# EAGLE design USBasp (EAGLE 6.3)
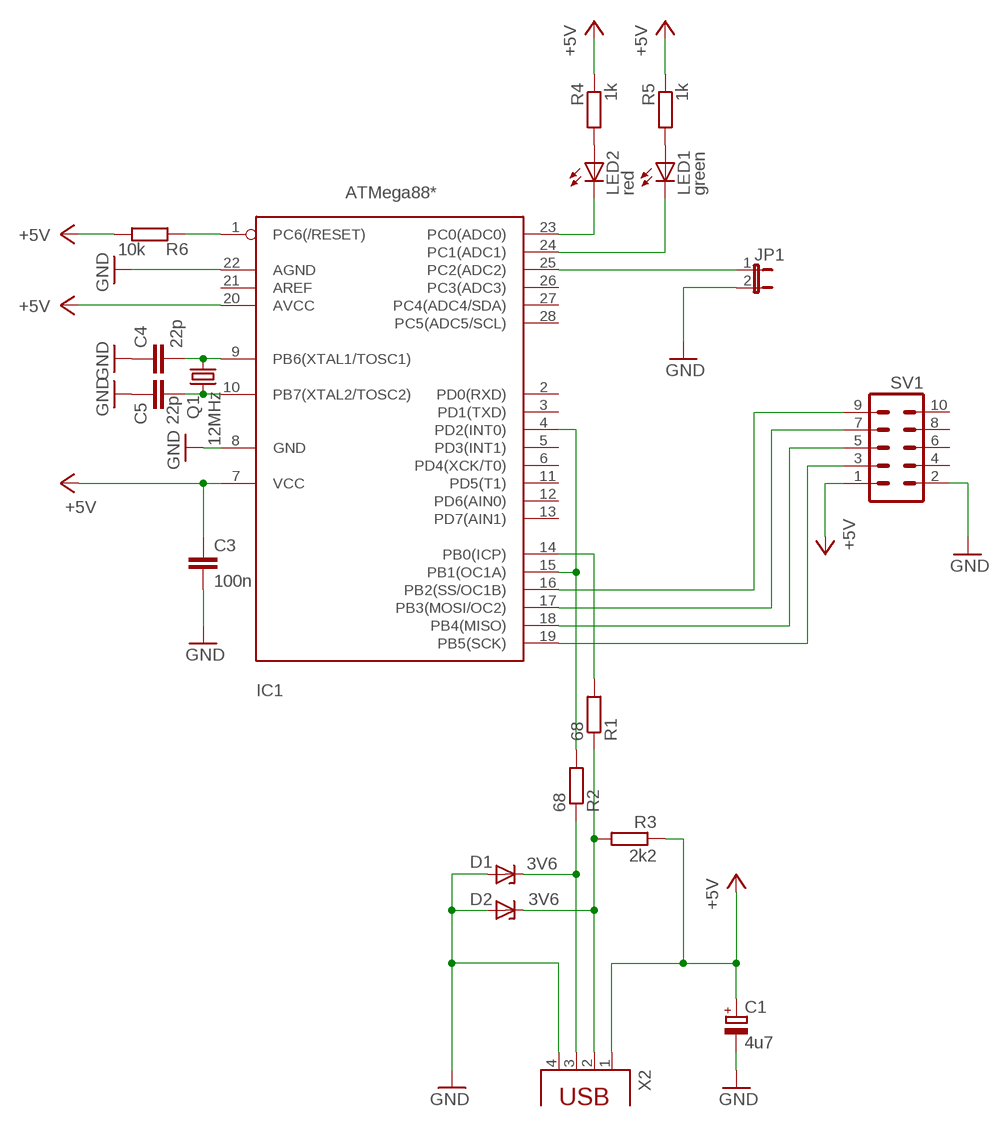
[diagram p0: schematic, sheet 1]

## Parts
C1  4u7  CPOL-EUE2.5-5  [E2,5-5]
C3  100n  C-EU025-024X044  [C025-024X044]
C4  22p  C-EU025-024X044  [C025-024X044]
C5  22p  C-EU025-024X044  [C025-024X044]
D1  3V6  ZENER-DIODEDO34-7  [DO34Z7]
D2  3V6  ZENER-DIODEDO34-7  [DO34Z7]
IC1  ATMega88*  MEGA8-P  [DIL28-3]
JP1  JP1E  [JP1]
LED1  green  LED3MM  [LED3MM]
LED2  red  LED3MM  [LED3MM]
Q1  12MHz  CRYTALHC49S  [HC49/S]
R1  68  R-EU_0207/10  [0207/10]
R2  68  R-EU_0207/10  [0207/10]
R3  2k2  R-EU_0207/10  [0207/10]
R4  1k  R-EU_0207/10  [0207/10]
R5  1k  R-EU_0207/10  [0207/10]
R6  10k  R-EU_0207/10  [0207/10]
SV1  MA05-2  [MA05-2]
X2  PN87520  [PN87520]

## Nets
+5V: C1.+ C3.1 IC1.7(VCC) IC1.20(AVCC) R3.1 R4.1 R5.1 R6.1 SV1.1 X2.1
GND: C1.- C3.2 C4.1 C5.1 D1.A D2.A IC1.8(GND) IC1.22(AGND) JP1.2 SV1.2 X2.4
N$1: IC1.25(PC2(ADC2)) JP1.1
N$2: IC1.19(PB5(SCK)) SV1.3
N$3: IC1.1(PC6(/RESET)) R6.2
N$4: IC1.18(PB4(MISO)) SV1.5
N$5: D2.C R1.1 R3.2 X2.2
N$6: IC1.17(PB3(MOSI/OC2)) SV1.7
N$7: IC1.4(PD2(INT0)) IC1.15(PB1(OC1A)) R2.2
N$8: D1.C R2.1 X2.3
N$9: IC1.16(PB2(SS/OC1B)) SV1.9
N$13: LED2.A R4.2
N$14: IC1.23(PC0(ADC0)) LED2.K(C)
N$15: IC1.24(PC1(ADC1)) LED1.K(C)
N$16: IC1.14(PB0(ICP)) R1.2
N$22: C4.2 IC1.9(PB6(XTAL1/TOSC1)) Q1.2
N$23: C5.2 IC1.10(PB7(XTAL2/TOSC2)) Q1.1
N$25: LED1.A R5.2
Unconnected: IC1.2(PD0(RXD)) IC1.3(PD1(TXD)) IC1.5(PD3(INT1)) IC1.6(PD4(XCK/T0)) IC1.11(PD5(T1)) IC1.12(PD6(AIN0)) IC1.13(PD7(AIN1)) IC1.21(AREF) IC1.26(PC3(ADC3)) IC1.27(PC4(ADC4/SDA)) IC1.28(PC5(ADC5/SCL)) SV1.4 SV1.6 SV1.8 SV1.10

## Library data of the parts
C1 = rcl:CPOL-EU: POLARIZED CAPACITOR, European symbol
C3-C5 = rcl:C-EU: CAPACITOR, European symbol
D1 D2 = diode:ZENER-DIODE: Z-Diode
IC1 = atmel:MEGA8-P: MICROCONTROLLER 8 Kbytes FLASH 1 kbytes SRAM 512 bytes EEPROM USART 4-channel 10 bit ADC 2-channel 8 bit ADC Source: avr.lbr
JP1 = jumper:JP1E: JUMPER
LED1 LED2 = led:LED: LED OSRAM: - CHIPLED LG R971, LG N971, LY N971, LG Q971, LY Q971, LO R971, LY R971 LH N974, LH R974 LS Q976, LO Q976, LY Q976 LO Q996 - Hyper CHIPLED LW Q18S LB Q993, LB Q99A, LB R99A - SideLED LS A670, LO A670, LY A670, LG A670, LP A670 LB A673, LV A673, LT A673, LW A673 LH A674 LY A675 LS A676, LA A676, LO A676, LY A676, LW A676 LS A679, LY A679, LG A679 - Hyper Micro SIDELED® LS Y876, LA Y876, LO Y876, LY Y876 LT Y87S - SmartLED LW L88C, LW L88S LB L89C, LB L89S, LG L890 LS L89K, LO L89K, LY L89K LS L896, LA L896, LO L896, LY L896 - TOPLED LS T670, LO T670, LY T670, LG T670, LP T670 LSG T670, LSP T670, LSY T670, LOP T670, LYG T670 LG T671, LOG T671, LSG T671 LB T673, LV T673, LT T673, LW T673 LH T674 LS T676, LA T676, LO T676, LY T676, LB T676, LH T676, LSB T676, LW T676 LB T67C, LV T67C, LT T67C, LS T67K, LO T67K, LY T67K, LW E67C LS E67B, LA E67B, LO E67B, LY E67B, LB E67C, LV E67C, LT E67C LW T67C LS T679, LY T679, LG T679 LS T770, LO T770, LY T770, LG T770, LP T770 LB T773, LV T773, LT T773, LW T773 LH T774 LS E675, LA E675, LY E675, LS T675 LS T776, LA T776, LO T776, LY T776, LB T776 LHGB T686 LT T68C, LB T68C - Hyper Mini TOPLED® LB M676 - Mini TOPLED Santana® LG M470 LS M47K, LO M47K, LY M47K Source: http://www.osram.convergy.de/
Q1 = crystal:CRYTAL: CRYSTAL
R1-R6 = rcl:R-EU_: RESISTOR, European symbol
SV1 = con-lstb:MA05-2: PIN HEADER; OC_FARNELL: unknown; OC_NEWARK: unknown
X2 = con-berg:PN87520: BERG USB connector; OC_FARNELL: unknown; OC_NEWARK: unknown

## Board
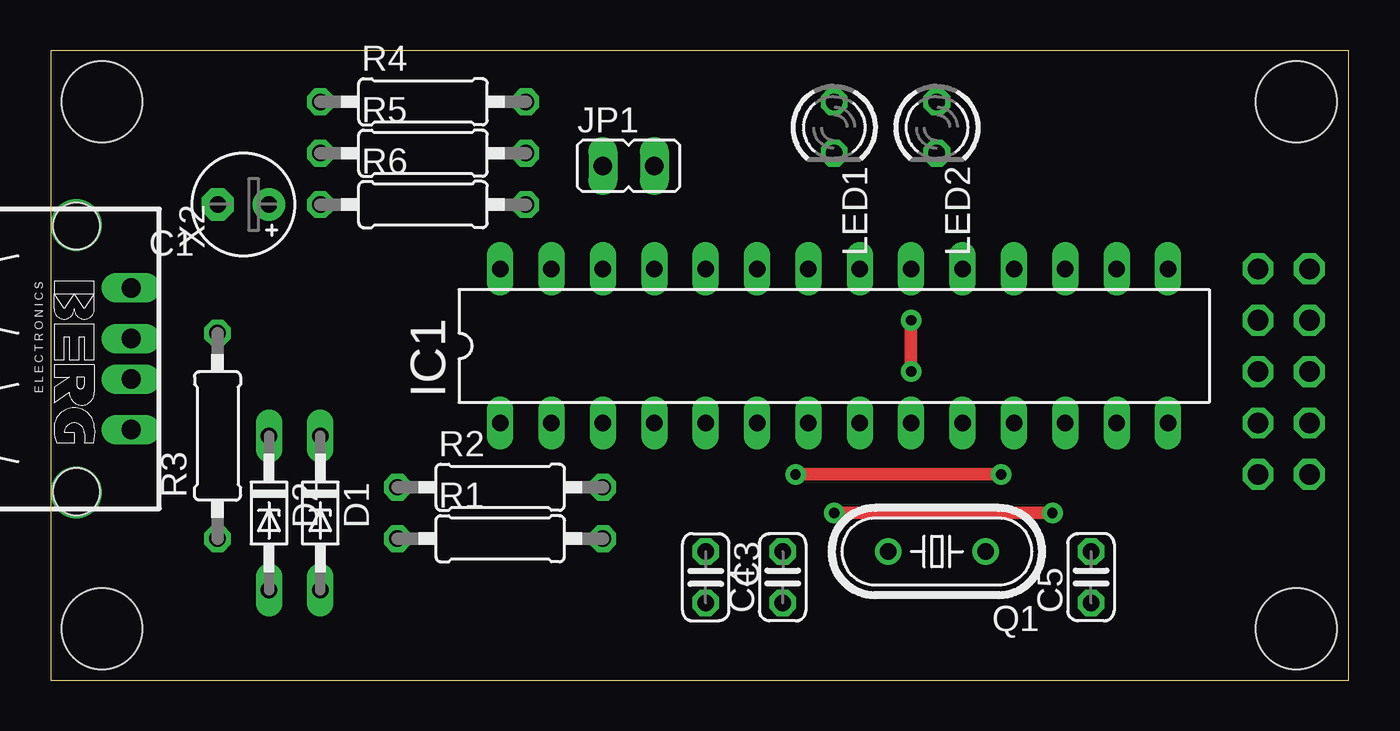
[diagram p1: board, top side]
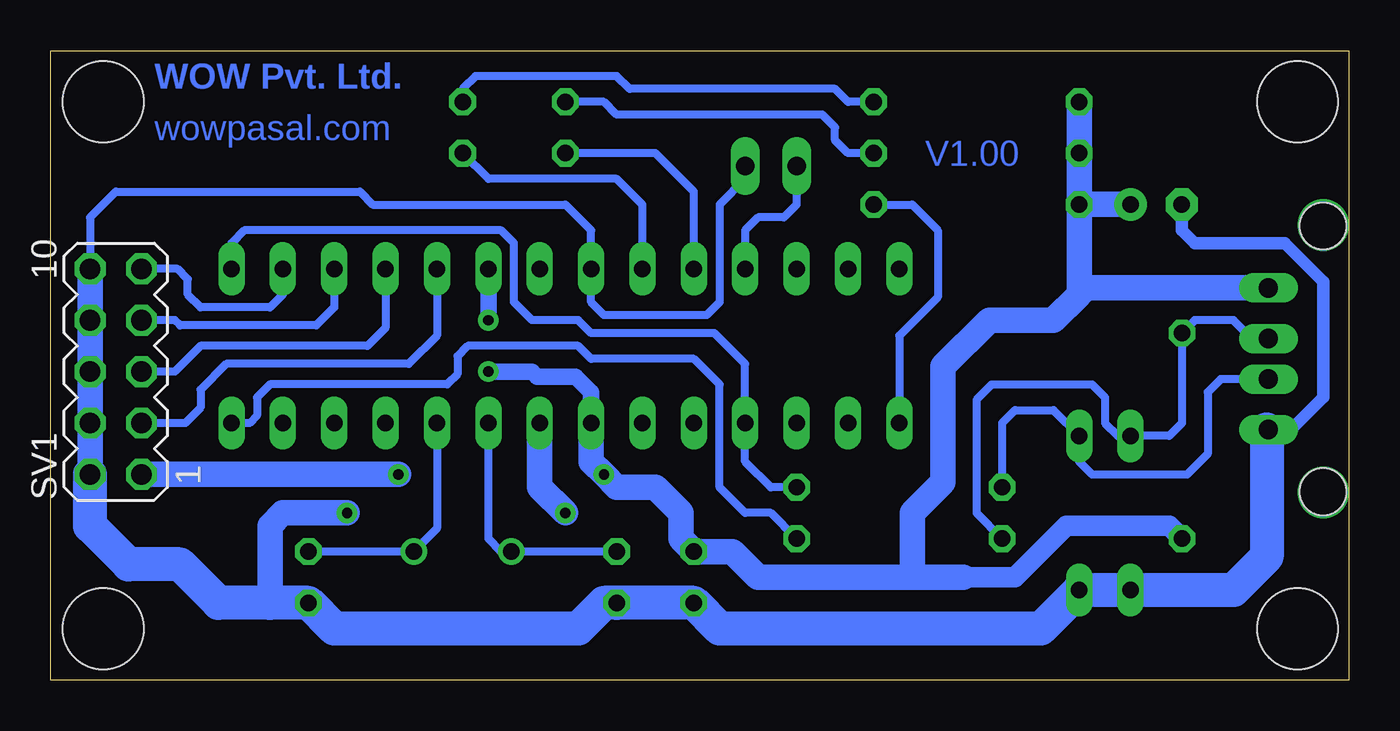
[diagram p2: board, bottom side, seen from below]

Size 64.19 x 31.11 mm. Coordinates in mm from the lower left corner, seen from the top.
Outline: 0,0 64.19,0 64.19,31.11 0,31.11 0,0
Copper layers (1*16): Top 0.035mm / dielectric 1.5mm / Bottom 0.035mm
Design rules "default": minimum track width 10mil, minimum drill 24mil, track to track 8mil, track to pad 8mil, pad to pad 8mil, via to via 8mil, smd to smd 8mil, copper to edge 40mil, drill to drill 8mil, minimum pad ring 10mil, minimum via ring 8mil, stop-mask expansion 4mil, vias tented up to drill 0mil, thermal gap 10mil
Holes 4 mm at 2.54,28.57 61.59,28.57 2.54,2.54 61.59,2.54

### Footprints (pad centres in the part's own frame; a part is rotated, then mirrored left to right if it is on the bottom)
E2,5-5 = drill 0.813 pad 1.6: + -1.27,0 | drill 0.813 pad 1.6 octagon: - 1.27,0
C025-024X044 = drill 0.813 octagon: 1 -1.27,0; 2 1.27,0
DO34Z7 = drill 0.813 long: A 3.81,0; C -3.81,0
DIL28-3 = drill 0.813 long: 1 -16.51,-3.81; 2 -13.97,-3.81; 3 -11.43,-3.81; 4 -8.89,-3.81; 5 -6.35,-3.81; 6 -3.81,-3.81; 7 -1.27,-3.81; 8 1.27,-3.81; 9 3.81,-3.81; 10 6.35,-3.81; 11 8.89,-3.81; 12 11.43,-3.81; 13 13.97,-3.81; 14 16.51,-3.81; 15 16.51,3.81; 16 13.97,3.81; 17 11.43,3.81; 18 8.89,3.81; 19 6.35,3.81; 20 3.81,3.81; 21 1.27,3.81; 22 -1.27,3.81; 23 -3.81,3.81; 24 -6.35,3.81; 25 -8.89,3.81; 26 -11.43,3.81; 27 -13.97,3.81; 28 -16.51,3.81
JP1 = drill 0.914 long: 1 0,-1.27; 2 0,1.27
LED3MM = drill 0.813 octagon: A -1.27,0; K 1.27,0
HC49/S = drill 0.813: 1 -2.413,0; 2 2.413,0
0207/10 = drill 0.813 octagon: 1 -5.08,0; 2 5.08,0
MA05-2 = drill 1.016 octagon: 1 -5.08,-1.27; 2 -5.08,1.27; 3 -2.54,-1.27; 4 -2.54,1.27; 5 0,-1.27; 6 0,1.27; 7 2.54,-1.27; 8 2.54,1.27; 9 5.08,-1.27; 10 5.08,1.27
PN87520 = drill 0.95 long: 1 -3.5,2.71; 2 -1,2.71; 3 1,2.71; 4 3.5,2.71 | hole 2.3: -6.57,0; 6.57,0

### Placement (x,y rotation side)
C1  9.53,23.5 180 top
C3  32.38,5.08 270 top
C4  36.2,5.08 90 top
C5  51.44,5.08 90 top
D1  13.34,8.26 270 top
D2  10.79,8.26 270 top
IC1  38.73,16.51 0 top
JP1  28.57,25.4 270 top
LED1  38.73,27.3 270 top
LED2  43.81,27.3 270 top
Q1  43.81,6.35 180 top
R1  22.23,6.99 0 top
R2  22.23,9.53 0 top
R3  8.26,12.06 90 top
R4  18.41,28.57 0 top
R5  18.41,26.04 0 top
R6  18.41,23.5 0 top
SV1  60.96,15.24 90 bottom
X2  1.27,15.88 270 top

### Tracks (layer width: path | path; a pad name or v marks a point on that pad's centre or on a via)
+5V  (via drill 0.51 pad 1.02)
  Top 0.61: v42.55,17.78 v42.55,15.24 | v36.83,10.16 v46.99,10.16
  Bottom 0.813: IC1.7 37.47,14.22 38.23,14.99 40.13,14.99 40.39,15.24 v42.55,15.24 | v42.55,17.78 IC1.20
  Bottom 1.016: 19.05,5.08 16.51,5.08 13.97,7.62 8.89,7.62 R3.1
  Bottom 1.27: R6.1 R5.1 R4.1 | SV1.1 v46.99,10.16 | 19.05,5.08 21.59,5.08 | 21.59,5.08 29.21,5.08 30.48,6.35 C3.1 33.02,6.99 33.02,8.26 34.29,9.53 36.2,9.53 v36.83,10.16 37.47,10.79 IC1.7 | R6.1 C1.+ | R6.1 13.34,19.05 | 21.59,5.08 21.59,8.26 20.07,9.78 20.07,15.49 17.78,17.78 14.61,17.78 13.34,19.05 | X2.1 13.01,19.38 13.34,19.05
GND  (via drill 0.51 pad 1.02)
  Top 0.61: v38.73,8.26 v49.53,8.26
  Bottom 0.406: 62.23,20.32 62.23,22.86 60.96,24.13 48.9,24.13 48.26,23.5 38.73,23.5 37.47,22.23 IC1.22 37.47,18.67 36.83,18.03 31.75,18.03 31.11,18.67 31.11,23.5 29.84,24.77 JP1.2
  Bottom 0.61: C1.- 8.26,22.23 7.62,21.59 3.17,21.59 1.27,19.68 1.27,13.97 2.79,12.45 3.91,12.45
  Bottom 1.27: SV1.2 62.23,20.32 | IC1.8 40.01,9.53 v38.73,8.26 | 3.91,12.45 X2.4 4.06,12.38 | v49.53,8.26 52.7,8.26 53.34,7.62 53.34,3.81
  Bottom 1.676: 4.06,12.38 4.06,6.1 5.71,4.45 D2.A D1.A 15.24,2.54 31.11,2.54 C3.2 C4.1 36.83,3.81 38.1,2.54 50.16,2.54 C5.1 53.34,3.81 55.88,3.81 57.78,5.71 60.33,5.71 62.23,7.62 SV1.2
N$1
  Bottom 0.406: JP1.1 27.3,23.5 27.94,22.86 29.21,22.86 29.84,22.23 IC1.25
N$2
  Bottom 0.406: SV1.3 57.53,12.7 56.77,13.46 56.77,14.35 55.5,15.62 46.48,15.62 45.09,17.02 IC1.19
N$3
  Bottom 0.406: R6.2 21.59,23.5 20.32,22.23 20.32,18.92 22.23,17.02 IC1.1
N$4
  Bottom 0.406: IC1.18 47.62,17.4 48.51,16.51 56.77,16.51 58.04,15.24 SV1.5
N$5
  Bottom 0.406: R1.1 18.41,8.26 18.41,13.84 17.65,14.61 12.7,14.61 12.06,13.97 12.06,12.7 11.43,12.06 D2.C 8.89,12.06 8.26,12.7 R3.2 7.62,17.78 5.71,17.78 4.81,16.88 X2.2
  Bottom 1.27: 10.79,11.94 D2.C
N$6
  Bottom 0.406: SV1.7 58.04,17.78 57.78,17.53 51.05,17.53 50.16,18.41 IC1.17
N$7
  Bottom 0.406: IC1.15 55.24,21.59 54.61,22.23 41.91,22.23 41.27,21.59 41.27,18.67 40.39,17.78 38.1,17.78 37.47,17.14 31.37,17.14 29.84,15.62 IC1.4 29.84,10.79 28.57,9.53 R2.2
N$8
  Bottom 0.406: R2.1 17.14,12.7 16.51,13.34 14.61,13.34 D1.C 13.34,10.79 12.7,10.16 8,10.16 6.99,11.18 6.99,14.22 6.33,14.88 X2.3
  Bottom 1.27: D1.C 13.34,12.19
N$9
  Bottom 0.406: IC1.16 52.7,19.05 53.34,18.41 56.77,18.41 57.4,19.05 57.4,19.81 57.91,20.32 SV1.9
N$12  (via drill 1 pad 2.54)
  other vias: 1.27,22.48
N$13
  Bottom 0.406: R4.2 24.77,28.57 25.4,29.21 35.56,29.21 36.2,29.84 43.18,29.84 43.81,29.21 LED2.A
N$14
  Bottom 0.406: IC1.23 34.92,23.5 36.2,24.77 42.55,24.77 LED2.K
N$15
  Bottom 0.406: IC1.24 32.38,24.13 34.29,26.04 LED1.K
N$16
  Bottom 0.406: R1.2 28.57,8.26 29.84,8.26 31.11,9.53 31.11,14.61 32.38,15.88 37.47,15.88 38.1,16.51 43.56,16.51 44.07,16 44.07,15.11 44.58,14.61 53.34,14.61 53.98,13.97 53.98,13.08 54.36,12.7 IC1.14
N$17  (via drill 1 pad 2.54)
  other vias: 1.27,9.27
N$22
  Bottom 0.406: C4.2 Q1.2 41.91,6.35 42.55,6.99 IC1.9
N$23
  Bottom 0.406: IC1.10 45.09,7.49 Q1.1 C5.2
N$25
  Bottom 0.406: R5.2 24.77,26.04 25.4,26.67 25.4,27.3 26.04,27.94 36.2,27.94 36.83,28.57 LED1.A

### Text on the board
Bottom: WOW Pvt. Ltd. | wowpasal.com | V1.00